# Altium schematic sheet 转接板.SchDoc
size A4
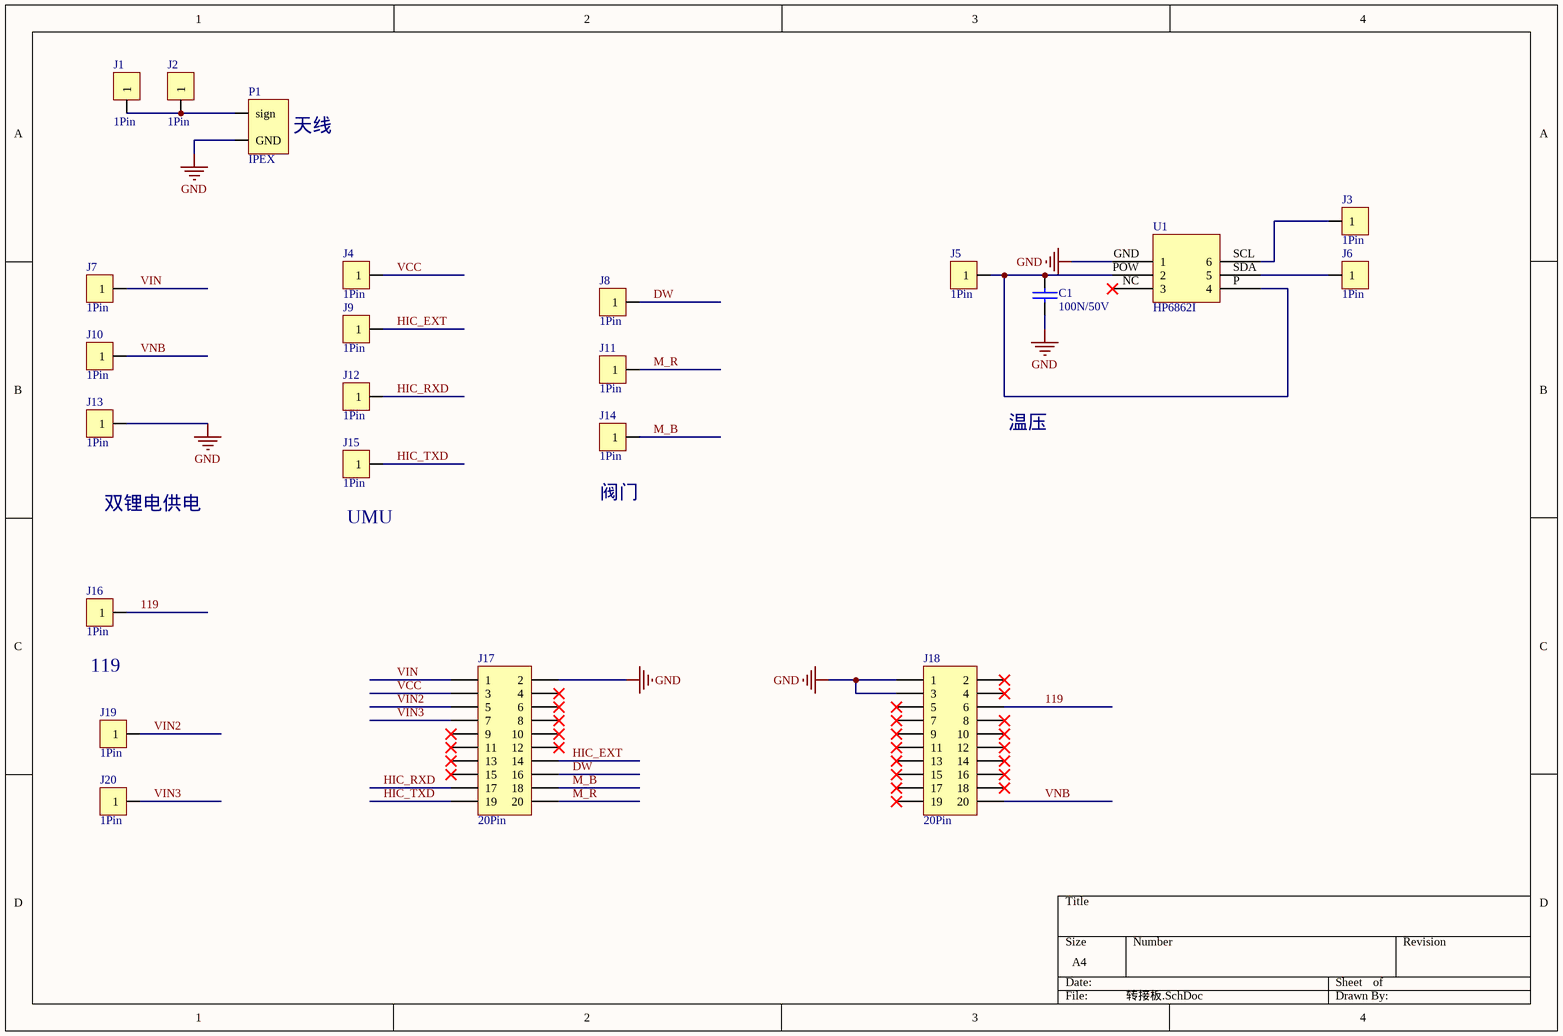
[diagram p0: 转接板.SchDoc]

## Parts
C1  100N/50V  [CAP0603]
J1  1Pin  [顶针孔1]
J2  1Pin  [顶针孔1]
J3  1Pin  [顶针孔1]
J4  1Pin  [顶针孔1]
J5  1Pin  [顶针孔1]
J6  1Pin  [顶针孔1]
J7  1Pin  [顶针孔1]
J8  1Pin  [顶针孔1]
J9  1Pin  [顶针孔1]
J10  1Pin  [顶针孔1]
J11  1Pin  [顶针孔1]
J12  1Pin  [顶针孔1]
J13  1Pin  [顶针孔1]
J14  1Pin  [顶针孔1]
J15  1Pin  [顶针孔1]
J16  1Pin  [顶针孔1]
J17  20Pin  [DC254_2*10 - duplicate]
J18  20Pin  [DC254_2*10 - duplicate]
J19  1Pin  [顶针孔1]
J20  1Pin  [顶针孔1]
P1  IPEX  [ANT-IPEX]
U1  HP6862I  [HP6862]

## Nets
GND: C1.2 J13.1 J17.2 J18.1 J18.3 P1.2(GND) U1.GND(1)
119: J16.1 J18.6
DW: J8.1 J17.16
HIC_EXT: J9.1 J17.14
HIC_RXD: J12.1 J17.17
HIC_TXD: J15.1 J17.19
M_B: J14.1 J17.18
M_R: J11.1 J17.20
VCC: J4.1 J17.3
VIN: J7.1 J17.1
VIN2: J17.5 J19.1
VIN3: J17.7 J20.1
VNB: J10.1 J18.20
NetC1_1: C1.1 J5.1 U1.P(4) U1.POW(2)
NetJ1_1: J1.1 J2.1 P1.1(sign)
NetJ3_1: J3.1 U1.SCL(6)
NetJ6_1: J6.1 U1.SDA(5)

Not connected (* = marked no-connect by the designer): J17 4* 6* 8* 9* 10* 11* 12* 13* 15*; J18 2* 4* 5* 7* 8* 9* 10* 11* 12* 13* 14* 15* 16* 17* 18* 19*; U1 NC(3)*

## Notes on the sheet
- (near P1) 天线
- 温压
- 双锂电供电
- (near J14) 阀门
- (near J15) UMU
- 119

## Library data of the parts
C1 = CC03K7R9B_100N: 100N/50V，±10%，0603; Part Number: 101020103-0021; Part Name: 0603贴片电容; ID: 34
J17 J18 = 20Pin: DC2 2.54mm 2x10pin,2.54mm间距，2x10pin，32×8.55×27.5mm,母头,双排,双排牛角座; Part Number: 1010902-0139; Part Name: DC牛角座; ID: 4; SMD/DIP: DIP
U1 = HP6862I: pin to pad: GND>1 NC>3 P>4 POW>2 SCL>6 SDA>5